# Altium schematic sheet norbi_lm_main.SchDoc: Имя
size 410 x 297 mm; ApprovedBy: Утвердил; CheckedBy: Проверил; Author: Разработал; Organization: НГУ; DocumentNumber: Децимальный номер Э3; SheetNumber: Лист; SheetTotal: Листов; PageSetup: Record=PageOptions|CenterHorizontal=True|CenterVertical=True|PrintScale=1.00|XCorrection=1.00|YCorrection=1.00|PrintKind=1|BorderSize=5000000|LeftOffset=0|BottomOffset=0|Orientation=2|PaperLength=1000|PaperWidth=1000|Scale=100|PaperSource=15|PrintQuality=1200|MediaType=1|DitherType=10|PaperKind=A3|PrintScaleMode=1; Weight: -; ScaleFactor: -; NormInspection: Норм.Контр.
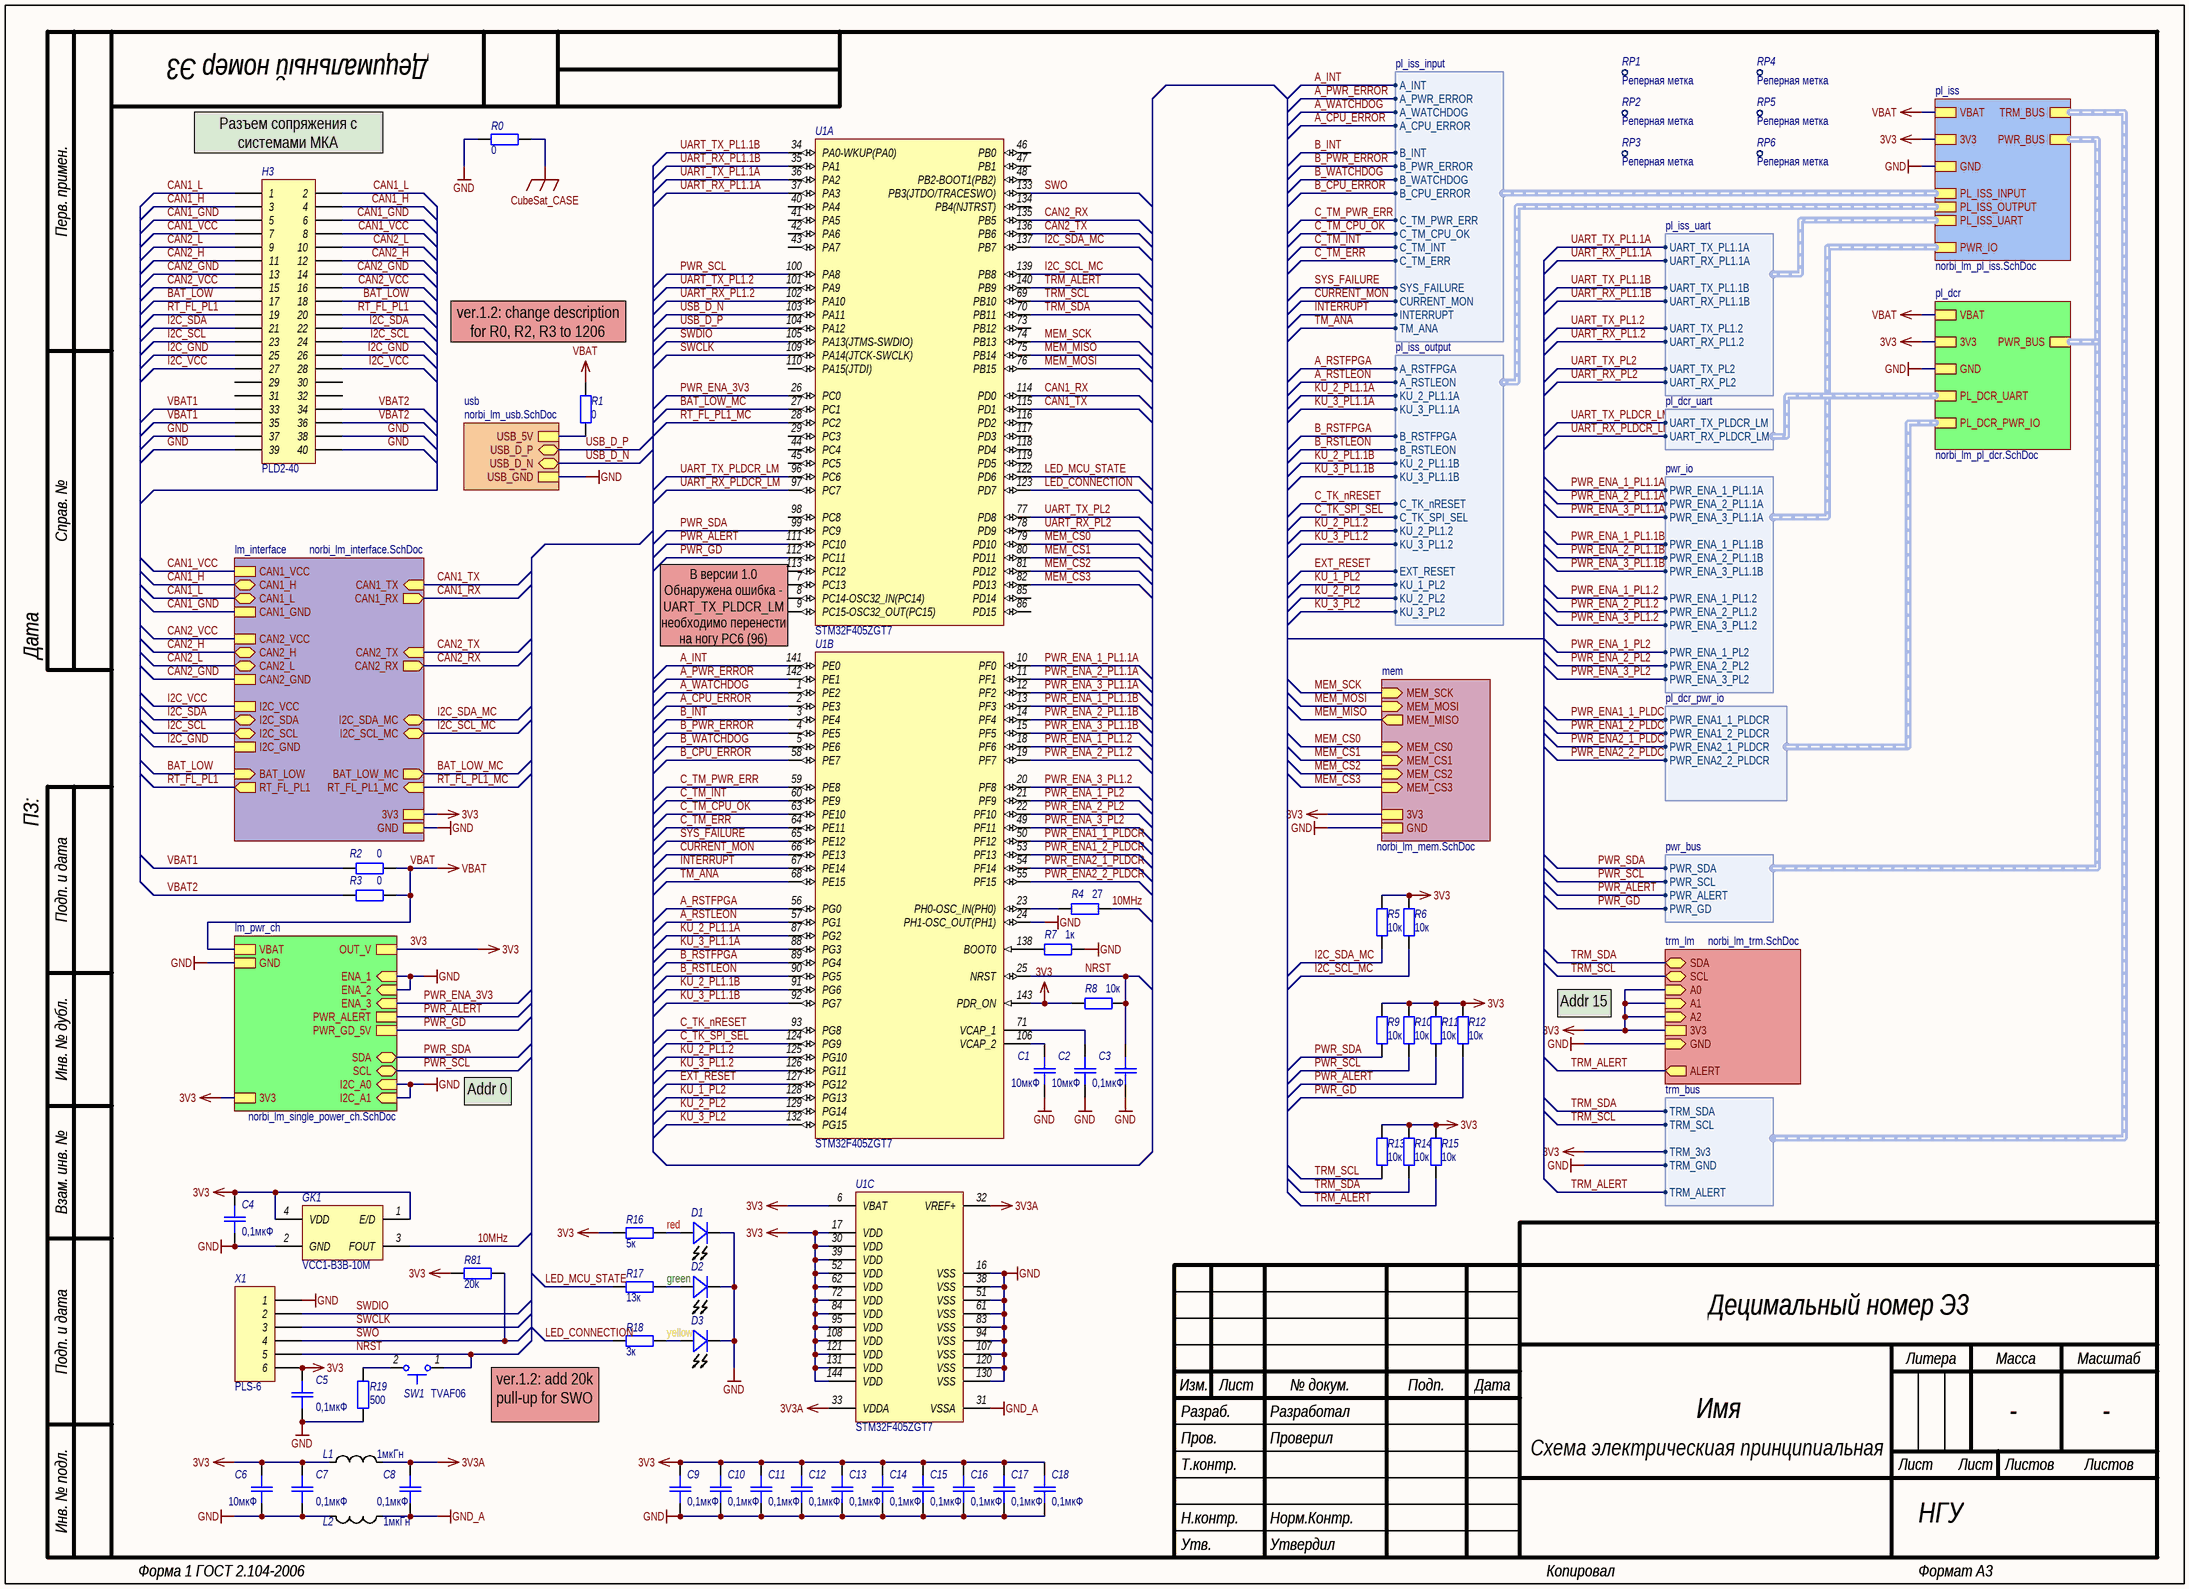
[diagram p0: norbi_lm_main.SchDoc]

## Parts
C1  10мкФ  [CR-0603]
C2  10мкФ  [CR-0603]
C3  0,1мкФ  [CR-0603]
C4  0,1мкФ  [CR-0603]
C5  0,1мкФ  [CR-0603]
C6  10мкФ  [CR-0603]
C7  0,1мкФ  [CR-0603]
C8  0,1мкФ  [CR-0603]
C9  0,1мкФ  [CR-0603]
C10  0,1мкФ  [CR-0603]
C11  0,1мкФ  [CR-0603]
C12  0,1мкФ  [CR-0603]
C13  0,1мкФ  [CR-0603]
C14  0,1мкФ  [CR-0603]
C15  0,1мкФ  [CR-0603]
C16  0,1мкФ  [CR-0603]
C17  0,1мкФ  [CR-0603]
C18  0,1мкФ  [CR-0603]
D1  value red  [LED-0805]  (hidden comment: LED)
D2  value green  [LED-0805]  (hidden comment: LED)
D3  value yellow  [LED-0805]  (hidden comment: LED)
GK1  Наименование: VCC1-B3B-10M  [5x7 Crystall Oscillatior]  (hidden comment: VCC1)
H3  Наименование: PLD2-40  [PLD2-40 (DS-1025-05 2x20)]  (hidden comment: Header 20X2H)
L1  1мкГн  [CR-0805]
L2  1мкГн  [CR-0805]
R0  0  [CR-0805]
R1  0  [CR-1206]
R2  0  [CR-1206]
R3  0  [CR-1206]
R4  27  [CR-0603]
R5  10к  [CR-0603]
R6  10к  [CR-0603]
R7  1к  [CR-0603]
R8  10к  [CR-0603]
R9  10к  [CR-0603]
R10  10к  [CR-0603]
R11  10к  [CR-0603]
R12  10к  [CR-0603]
R13  10к  [CR-0603]
R14  10к  [CR-0603]
R15  10к  [CR-0603]
R16  5к  [CR-0603]
R17  13к  [CR-0603]
R18  3к  [CR-0603]
R19  500  [CR-0603]
R81  20k  [CR-0603]
RP1  Наименование: Реперная метка  [ReperPoint]  (hidden comment: RP)
RP2  Наименование: Реперная метка  [ReperPoint]  (hidden comment: RP)
RP3  Наименование: Реперная метка  [ReperPoint]  (hidden comment: RP)
RP4  Наименование: Реперная метка  [ReperPoint]  (hidden comment: RP)
RP5  Наименование: Реперная метка  [ReperPoint]  (hidden comment: RP)
RP6  Наименование: Реперная метка  [ReperPoint]  (hidden comment: RP)
SW1  Push button  [TVAF06]  (value not drawn)
U1  STM32F405ZGT7  [LQFP144]  (parts A,B,C of 3)
X1  Наименование: PLS-6  [HDR1X6]  (hidden comment: Header 6)

## Sub-sheets
lm_interface = norbi_lm_interface.SchDoc: RT_FL_PL1 (out), I2C_SCL_MC (bidir), CAN1_L (bidir), CAN2_H (bidir), CAN2_VCC, RT_FL_PL1_MC (in), I2C_VCC, I2C_SDA (bidir), CAN2_GND, I2C_GND, CAN1_VCC, I2C_SCL (bidir), CAN1_H (bidir), GND, BAT_LOW (in), BAT_LOW_MC (out), CAN1_GND, CAN2_L (bidir), 3V3, I2C_SDA_MC (bidir), CAN2_TX (in), CAN2_RX (out), CAN1_TX (in), CAN1_RX (out)
lm_pwr_ch = norbi_lm_single_power_ch.SchDoc: SDA (bidir), SCL (bidir), ENA_1 (in), ENA_2 (in), ENA_3 (in), I2C_A0 (in), I2C_A1 (in), VBAT, 3V3, GND, PWR_ALERT, PWR_GD_5V, OUT_V  | R17_value: 1М; R22_value: NU; R21_value: NU; R20_value: 100; R18_value: 300к; R27_value: 10к; R1_5V_value: 150к; R2_5V_value: 47к; PULL_UP_I2C: NU
mem = norbi_lm_mem.SchDoc: 3V3, MEM_CS3 (in), GND, MEM_CS2 (in), MEM_CS1 (in), MEM_CS0 (in), MEM_SCK (in), MEM_MISO (out), MEM_MOSI (in)
pl_dcr = norbi_lm_pl_dcr.SchDoc: PL_DCR_UART (harness pl_dcr_uart), 3V3, VBAT, PL_DCR_PWR_IO (harness pl_dcr_pwr_io), PWR_BUS (harness pwr_bus), GND
pl_iss = norbi_lm_pl_iss.SchDoc: VBAT, PL_ISS_INPUT (harness pl_iss_input), GND, PL_ISS_OUTPUT (harness pl_iss_output), 3V3, PL_ISS_UART (harness pl_iss_uart), PWR_IO (harness pwr_io), TRM_BUS (harness trm_bus), PWR_BUS (harness pwr_bus)
trm_lm = norbi_lm_trm.SchDoc: A2 (in), A1 (in), A0 (in), ALERT (out), GND (in), 3V3, SCL (bidir), SDA (bidir)
usb = norbi_lm_usb.SchDoc: USB_D_N (bidir), USB_GND, USB_5V, USB_D_P (bidir)

## Harnesses
trm_bus: TRM_3v3, TRM_SDA, TRM_SCL, TRM_ALERT, TRM_GND
pwr_bus: PWR_SDA, PWR_SCL, PWR_ALERT, PWR_GD
pl_iss_uart: UART_TX_PL1.1A, UART_RX_PL1.1A, UART_TX_PL1.1B, UART_RX_PL1.1B, UART_TX_PL1.2, UART_RX_PL1.2, UART_TX_PL2, UART_RX_PL2
pwr_io: PWR_ENA_1_PL1.1A, PWR_ENA_2_PL1.1A, PWR_ENA_3_PL1.1A, PWR_ENA_1_PL1.1B, PWR_ENA_2_PL1.1B, PWR_ENA_3_PL1.1B, PWR_ENA_1_PL1.2, PWR_ENA_2_PL1.2, PWR_ENA_3_PL1.2, PWR_ENA_1_PL2, PWR_ENA_2_PL2, PWR_ENA_3_PL2
pl_iss_input: A_INT, A_PWR_ERROR, A_WATCHDOG, A_CPU_ERROR, B_INT, B_PWR_ERROR, B_WATCHDOG, B_CPU_ERROR, C_TM_PWR_ERR, C_TM_CPU_OK, C_TM_INT, C_TM_ERR, SYS_FAILURE, CURRENT_MON, INTERRUPT, TM_ANA
pl_dcr_uart: UART_TX_PLDCR_LM, UART_RX_PLDCR_LM
pl_iss_output: A_RSTFPGA, A_RSTLEON, KU_2_PL1.1A, KU_3_PL1.1A, B_RSTFPGA, B_RSTLEON, KU_2_PL1.1B, KU_3_PL1.1B, C_TK_nRESET, C_TK_SPI_SEL, KU_2_PL1.2, KU_3_PL1.2, EXT_RESET, KU_1_PL2, KU_2_PL2, KU_3_PL2
pl_dcr_pwr_io: PWR_ENA1_1_PLDCR, PWR_ENA1_2_PLDCR, PWR_ENA2_1_PLDCR, PWR_ENA2_2_PLDCR

## Nets
3V3: C4.2 C5.2 C6.2 C7.2 C9.2 C10.2 C11.2 C12.2 C13.2 C14.2 C15.2 C16.2 C17.2 C18.2 GK1.1(E/D) GK1.4(VDD) L1.1 R5.1 R6.1 R8.2 R9.1 R10.1 R11.1 R12.1 R13.1 R14.1 R15.1 R16.1 R81.1 U1.6(VBAT) U1.17(VDD) U1.30(VDD) U1.39(VDD) U1.52(VDD) U1.62(VDD) U1.72(VDD) U1.84(VDD) U1.95(VDD) U1.108(VDD) U1.121(VDD) U1.131(VDD) U1.143(PDR_ON) U1.144(VDD) X1.6 ; sheet pl_iss/3V3, sheet pl_dcr/3V3, sheet lm_interface/3V3, sheet trm_lm/A2, sheet trm_lm/A1, sheet trm_lm/A0, sheet trm_lm/3V3, sheet mem/3V3, sheet lm_pwr_ch/3V3, sheet lm_pwr_ch/OUT_V, sheet pl_iss/TRM_BUS.TRM_3v3
3V3A: C8.2 L1.2 U1.32(VREF+) U1.33(VDDA)
CubeSat_CASE: R0.1
GND: C1.1 C2.1 C3.1 C4.1 C5.1 C6.1 C7.1 C9.1 C10.1 C11.1 C12.1 C13.1 C14.1 C15.1 C16.1 C17.1 C18.1 D1.2(K) D2.2(K) D3.2(K) GK1.2(GND) H3.37 H3.38 H3.39 H3.40 L2.2 R0.2 R7.1 R19.2 U1.16(VSS) U1.24(PH1-OSC_OUT(PH1)) U1.38(VSS) U1.51(VSS) U1.61(VSS) U1.83(VSS) U1.94(VSS) U1.107(VSS) U1.120(VSS) U1.130(VSS) X1.1 ; sheet pl_iss/GND, sheet pl_dcr/GND, sheet lm_interface/GND, sheet trm_lm/GND, sheet mem/GND, sheet lm_pwr_ch/ENA_1, sheet lm_pwr_ch/ENA_2, sheet lm_pwr_ch/I2C_A0, sheet lm_pwr_ch/I2C_A1, sheet lm_pwr_ch/GND, sheet usb/USB_GND, sheet pl_iss/TRM_BUS.TRM_GND
GND_A: C8.1 L2.1 U1.31(VSSA)
VBAT: R1.2 R2.2 R3.2 ; sheet pl_iss/VBAT, sheet pl_dcr/VBAT, sheet lm_pwr_ch/VBAT
10MHz: GK1.3(FOUT) R4.2
A_CPU_ERROR: U1.2(PE3) ; sheet pl_iss/PL_ISS_INPUT.A_CPU_ERROR
A_INT: U1.141(PE0) ; sheet pl_iss/PL_ISS_INPUT.A_INT
A_PWR_ERROR: U1.142(PE1) ; sheet pl_iss/PL_ISS_INPUT.A_PWR_ERROR
A_RSTFPGA: U1.56(PG0) ; sheet pl_iss/PL_ISS_OUTPUT.A_RSTFPGA
A_RSTLEON: U1.57(PG1) ; sheet pl_iss/PL_ISS_OUTPUT.A_RSTLEON
A_WATCHDOG: U1.1(PE2) ; sheet pl_iss/PL_ISS_INPUT.A_WATCHDOG
B_CPU_ERROR: U1.58(PE7) ; sheet pl_iss/PL_ISS_INPUT.B_CPU_ERROR
B_INT: U1.3(PE4) ; sheet pl_iss/PL_ISS_INPUT.B_INT
B_PWR_ERROR: U1.4(PE5) ; sheet pl_iss/PL_ISS_INPUT.B_PWR_ERROR
B_RSTFPGA: U1.89(PG4) ; sheet pl_iss/PL_ISS_OUTPUT.B_RSTFPGA
B_RSTLEON: U1.90(PG5) ; sheet pl_iss/PL_ISS_OUTPUT.B_RSTLEON
B_WATCHDOG: U1.5(PE6) ; sheet pl_iss/PL_ISS_INPUT.B_WATCHDOG
BAT_LOW: H3.17 H3.18 ; sheet lm_interface/BAT_LOW
BAT_LOW_MC: U1.27(PC1) ; sheet lm_interface/BAT_LOW_MC
C_TK_nRESET: U1.93(PG8) ; sheet pl_iss/PL_ISS_OUTPUT.C_TK_nRESET
C_TK_SPI_SEL: U1.124(PG9) ; sheet pl_iss/PL_ISS_OUTPUT.C_TK_SPI_SEL
C_TM_CPU_OK: U1.63(PE10) ; sheet pl_iss/PL_ISS_INPUT.C_TM_CPU_OK
C_TM_ERR: U1.64(PE11) ; sheet pl_iss/PL_ISS_INPUT.C_TM_ERR
C_TM_INT: U1.60(PE9) ; sheet pl_iss/PL_ISS_INPUT.C_TM_INT
C_TM_PWR_ERR: U1.59(PE8) ; sheet pl_iss/PL_ISS_INPUT.C_TM_PWR_ERR
CAN1_GND: H3.5 H3.6 ; sheet lm_interface/CAN1_GND
CAN1_H: H3.3 H3.4 ; sheet lm_interface/CAN1_H
CAN1_L: H3.1 H3.2 ; sheet lm_interface/CAN1_L
CAN1_RX: U1.114(PD0) ; sheet lm_interface/CAN1_RX
CAN1_TX: U1.115(PD1) ; sheet lm_interface/CAN1_TX
CAN1_VCC: H3.7 H3.8 ; sheet lm_interface/CAN1_VCC
CAN2_GND: H3.13 H3.14 ; sheet lm_interface/CAN2_GND
CAN2_H: H3.11 H3.12 ; sheet lm_interface/CAN2_H
CAN2_L: H3.9 H3.10 ; sheet lm_interface/CAN2_L
CAN2_RX: U1.135(PB5) ; sheet lm_interface/CAN2_RX
CAN2_TX: U1.136(PB6) ; sheet lm_interface/CAN2_TX
CAN2_VCC: H3.15 H3.16 ; sheet lm_interface/CAN2_VCC
CURRENT_MON: U1.66(PE13) ; sheet pl_iss/PL_ISS_INPUT.CURRENT_MON
EXT_RESET: U1.127(PG12) ; sheet pl_iss/PL_ISS_OUTPUT.EXT_RESET
I2C_GND: H3.25 H3.26 ; sheet lm_interface/I2C_GND
I2C_SCL: H3.23 H3.24 ; sheet lm_interface/I2C_SCL
I2C_SCL_MC: R6.2 U1.139(PB8) ; sheet lm_interface/I2C_SCL_MC
I2C_SDA: H3.21 H3.22 ; sheet lm_interface/I2C_SDA
I2C_SDA_MC: R5.2 U1.137(PB7) ; sheet lm_interface/I2C_SDA_MC
I2C_VCC: H3.27 H3.28 ; sheet lm_interface/I2C_VCC
INTERRUPT: U1.67(PE14) ; sheet pl_iss/PL_ISS_INPUT.INTERRUPT
KU_1_PL2: U1.128(PG13) ; sheet pl_iss/PL_ISS_OUTPUT.KU_1_PL2
KU_2_PL1.1A: U1.87(PG2) ; sheet pl_iss/PL_ISS_OUTPUT.KU_2_PL1.1A
KU_2_PL1.1B: U1.91(PG6) ; sheet pl_iss/PL_ISS_OUTPUT.KU_2_PL1.1B
KU_2_PL1.2: U1.125(PG10) ; sheet pl_iss/PL_ISS_OUTPUT.KU_2_PL1.2
KU_2_PL2: U1.129(PG14) ; sheet pl_iss/PL_ISS_OUTPUT.KU_2_PL2
KU_3_PL1.1A: U1.88(PG3) ; sheet pl_iss/PL_ISS_OUTPUT.KU_3_PL1.1A
KU_3_PL1.1B: U1.92(PG7) ; sheet pl_iss/PL_ISS_OUTPUT.KU_3_PL1.1B
KU_3_PL1.2: U1.126(PG11) ; sheet pl_iss/PL_ISS_OUTPUT.KU_3_PL1.2
KU_3_PL2: U1.132(PG15) ; sheet pl_iss/PL_ISS_OUTPUT.KU_3_PL2
LED_CONNECTION: R18.1 U1.123(PD7)
LED_MCU_STATE: R17.1 U1.122(PD6)
MEM_CS0: U1.79(PD10) ; sheet mem/MEM_CS0
MEM_CS1: U1.80(PD11) ; sheet mem/MEM_CS1
MEM_CS2: U1.81(PD12) ; sheet mem/MEM_CS2
MEM_CS3: U1.82(PD13) ; sheet mem/MEM_CS3
MEM_MISO: U1.75(PB14) ; sheet mem/MEM_MISO
MEM_MOSI: U1.76(PB15) ; sheet mem/MEM_MOSI
MEM_SCK: U1.74(PB13) ; sheet mem/MEM_SCK
NRST: C3.2 R8.1 SW1.1 U1.25(NRST) X1.5
PWR_ALERT: R11.2 U1.111(PC10) ; sheet lm_pwr_ch/PWR_ALERT, sheet pl_iss/PWR_BUS.PWR_ALERT
PWR_ENA1_1_PLDCR: U1.50(PF12) ; sheet pl_dcr/PL_DCR_PWR_IO.PWR_ENA1_1_PLDCR
PWR_ENA1_2_PLDCR: U1.53(PF13) ; sheet pl_dcr/PL_DCR_PWR_IO.PWR_ENA1_2_PLDCR
PWR_ENA2_1_PLDCR: U1.54(PF14) ; sheet pl_dcr/PL_DCR_PWR_IO.PWR_ENA2_1_PLDCR
PWR_ENA2_2_PLDCR: U1.55(PF15) ; sheet pl_dcr/PL_DCR_PWR_IO.PWR_ENA2_2_PLDCR
PWR_ENA_1_PL1.1A: U1.10(PF0) ; sheet pl_iss/PWR_IO.PWR_ENA_1_PL1.1A
PWR_ENA_1_PL1.1B: U1.13(PF3) ; sheet pl_iss/PWR_IO.PWR_ENA_1_PL1.1B
PWR_ENA_1_PL1.2: U1.18(PF6) ; sheet pl_iss/PWR_IO.PWR_ENA_1_PL1.2
PWR_ENA_1_PL2: U1.21(PF9) ; sheet pl_iss/PWR_IO.PWR_ENA_1_PL2
PWR_ENA_2_PL1.1A: U1.11(PF1) ; sheet pl_iss/PWR_IO.PWR_ENA_2_PL1.1A
PWR_ENA_2_PL1.1B: U1.14(PF4) ; sheet pl_iss/PWR_IO.PWR_ENA_2_PL1.1B
PWR_ENA_2_PL1.2: U1.19(PF7) ; sheet pl_iss/PWR_IO.PWR_ENA_2_PL1.2
PWR_ENA_2_PL2: U1.22(PF10) ; sheet pl_iss/PWR_IO.PWR_ENA_2_PL2
PWR_ENA_3_PL1.1A: U1.12(PF2) ; sheet pl_iss/PWR_IO.PWR_ENA_3_PL1.1A
PWR_ENA_3_PL1.1B: U1.15(PF5) ; sheet pl_iss/PWR_IO.PWR_ENA_3_PL1.1B
PWR_ENA_3_PL1.2: U1.20(PF8) ; sheet pl_iss/PWR_IO.PWR_ENA_3_PL1.2
PWR_ENA_3_PL2: U1.49(PF11) ; sheet pl_iss/PWR_IO.PWR_ENA_3_PL2
PWR_ENA_3V3: U1.26(PC0) ; sheet lm_pwr_ch/ENA_3
PWR_GD: R12.2 U1.112(PC11) ; sheet lm_pwr_ch/PWR_GD_5V, sheet pl_iss/PWR_BUS.PWR_GD
PWR_SCL: R10.2 U1.100(PA8) ; sheet lm_pwr_ch/SCL, sheet pl_iss/PWR_BUS.PWR_SCL
PWR_SDA: R9.2 U1.99(PC9) ; sheet lm_pwr_ch/SDA, sheet pl_iss/PWR_BUS.PWR_SDA
RT_FL_PL1: H3.19 H3.20 ; sheet lm_interface/RT_FL_PL1
RT_FL_PL1_MC: U1.28(PC2) ; sheet lm_interface/RT_FL_PL1_MC
SWCLK: U1.109(PA14(JTCK-SWCLK)) X1.3
SWDIO: U1.105(PA13(JTMS-SWDIO)) X1.2
SWO: R81.2 U1.133(PB3(JTDO/TRACESWO)) X1.4
SYS_FAILURE: U1.65(PE12) ; sheet pl_iss/PL_ISS_INPUT.SYS_FAILURE
TM_ANA: U1.68(PE15) ; sheet pl_iss/PL_ISS_INPUT.TM_ANA
TRM_ALERT: R15.2 U1.140(PB9) ; sheet trm_lm/ALERT, sheet pl_iss/TRM_BUS.TRM_ALERT
TRM_SCL: R13.2 U1.69(PB10) ; sheet trm_lm/SCL, sheet pl_iss/TRM_BUS.TRM_SCL
TRM_SDA: R14.2 U1.70(PB11) ; sheet trm_lm/SDA, sheet pl_iss/TRM_BUS.TRM_SDA
UART_RX_PL1.1A: U1.37(PA3) ; sheet pl_iss/PL_ISS_UART.UART_RX_PL1.1A
UART_RX_PL1.1B: U1.35(PA1) ; sheet pl_iss/PL_ISS_UART.UART_RX_PL1.1B
UART_RX_PL1.2: U1.102(PA10) ; sheet pl_iss/PL_ISS_UART.UART_RX_PL1.2
UART_RX_PL2: U1.78(PD9) ; sheet pl_iss/PL_ISS_UART.UART_RX_PL2
UART_RX_PLDCR_LM: U1.97(PC7) ; sheet pl_dcr/PL_DCR_UART.UART_RX_PLDCR_LM
UART_TX_PL1.1A: U1.36(PA2) ; sheet pl_iss/PL_ISS_UART.UART_TX_PL1.1A
UART_TX_PL1.1B: U1.34(PA0-WKUP(PA0)) ; sheet pl_iss/PL_ISS_UART.UART_TX_PL1.1B
UART_TX_PL1.2: U1.101(PA9) ; sheet pl_iss/PL_ISS_UART.UART_TX_PL1.2
UART_TX_PL2: U1.77(PD8) ; sheet pl_iss/PL_ISS_UART.UART_TX_PL2
UART_TX_PLDCR_LM: U1.96(PC6) ; sheet pl_dcr/PL_DCR_UART.UART_TX_PLDCR_LM
USB_D_N: U1.103(PA11) ; sheet usb/USB_D_N
USB_D_P: U1.104(PA12) ; sheet usb/USB_D_P
VBAT1: H3.33 H3.35 R2.1
VBAT2: H3.34 H3.36 R3.1
NetC1_2: C1.2 U1.106(VCAP_2)
NetC2_2: C2.2 U1.71(VCAP_1)
NetD1_1: D1.1(A) R16.2
NetD2_1: D2.1(A) R17.2
NetD3_1: D3.1(A) R18.2
NetR1_1: R1.1 ; sheet usb/USB_5V
NetR4_1: R4.1 U1.23(PH0-OSC_IN(PH0))
NetR7_2: R7.2 U1.138(BOOT0)
NetR19_1: R19.1 SW1.2

Not connected (* = marked no-connect by the designer): H3 29 30 31 32; U1 7(PC13) 8(PC14-OSC32_IN(PC14)) 9(PC15-OSC32_OUT(PC15)) 29(PC3) 40(PA4) 41(PA5) 42(PA6) 43(PA7) 44(PC4) 45(PC5) 46(PB0) 47(PB1) 48(PB2-BOOT1(PB2)) 73(PB12) 85(PD14) 86(PD15) 98(PC8) 110(PA15(JTDI)) 113(PC12) 116(PD2) 117(PD3) 118(PD4) 119(PD5) 134(PB4(NJTRST))

## Buses and harness runs
harness sheet pl_dcr/PWR_BUS = sheet pl_iss/PWR_BUS

## Notes on the sheet
- (near H3) Разъем сопряжения с системами МКА
- ver.1.2: change description for R0, R2, R3 to 1206
- (near U1) В версии 1.0 Обнаружена ошибка - UART_TX_PLDCR_LM необходимо перенести на ногу PC6 (96)
- Addr 15
- Addr 0
- ver.1.2: add 20k pull-up for SWO
- Перв. примен.
- Справ. №
- ПЗ:                             Дата
- Подп. и дата
- Инв. № дубл.
- Взам. инв. №
- Разраб.
- Изм.
- Лист
- № докум.
- Подп.
- Дата
- Литера
- Масса
- Масштаб
- Пров.
- Т.контр.
- Схема электрическиая принципиальная
- Листов
- Инв. № подл.
- Н.контр.
- Утв.
- Форма 1 ГОСТ 2.104-2006
- Копировал
- Формат А3

## Library data of the parts
C1-C18 = C_smd: Конденсатор для поверхностного монтажа; Назначение: Чип-конденсатор; Потребление, Вт: 0; Наименование: SMD-0603
  C1 C2 C6: Value: 10мкФ
  C3-C5 C7-C18: Value: 0,1мкФ
D1-D3 = LED: Назначение: Светодиод; Наименование: LED SMD-0805; Потребление, Вт: 0,01
GK1 = Crystall Oscillator: Назначение: Кварцевый генератор 7x5мм 20 МГц; Потребление, Вт: 0,01
H3 = HDR2X20: Header, 20-Pin, Dual row, Right Angle; Потребление, Вт: 0,0; Назначение: Header, 20-Pin, Dual row, Right Angle
L1 L2 = L_smd: Индуктивность для поверхностнгого монтажа; Назначение: Чип-индуктивность; Потребление, Вт: 0,010; Value: 1мкГн; Наименование: Индуктивность
R0 R4-R19 R81 = R_smd: Резистор для поверхностного монтажа; Наименование: SMD-0603,  20%; Назначение: Чип-резистор; Потребление, Вт: 0,001
  R0: Value: 0
  R4: Value: 27
  R5 R6 R8-R15: Value: 10к
  R7: Value: 1к
  R16: Value: 5к
  R17: Value: 13к
  R18: Value: 3к
  R19: Value: 500
  R81: Value: 20k
R1-R3 = R_smd: Резистор для поверхностного монтажа; Наименование: SMD-1206,  20%; Назначение: Чип-резистор; Потребление, Вт: 0,001; Value: 0
RP1-RP6 = RP: Назначение: реперная метка для автоматического монтажа
SW1 = Push_Button: Потребление, Вт: 0,001; Назначение: Push button; Наименование: TVAF06
U1 = STM32F405ZGT: ARM Cortex-M4 32-bit MCU+FPU, 210 DMIPS, 1024 kB Flash, 192 kB Internal RAM, 114 I/Os, 144-pin LQFP, -40 to 105 degC, Tray; Наименование: STM32F405ZGT7; Назначение: ARM Cortex-M4 32-bit MCU+FPU; Потребление, Вт: *; ComponentLink1Description: Datasheet; ComponentLink1URL: http://www.st.com/st-web-ui/static/active/en/resource/technical/document/datasheet/DM00037051.pdf
X1 = Header 6: Header, 6-Pin; Назначение: Отладочный разъем; LatestRevisionDate: 17-Jul-2002; LatestRevisionNote: Re-released for DXP Platform.; Publisher: Altium Limited